# EAGLE schematic Attiny84_PIR_RELE (EAGLE 6.4)
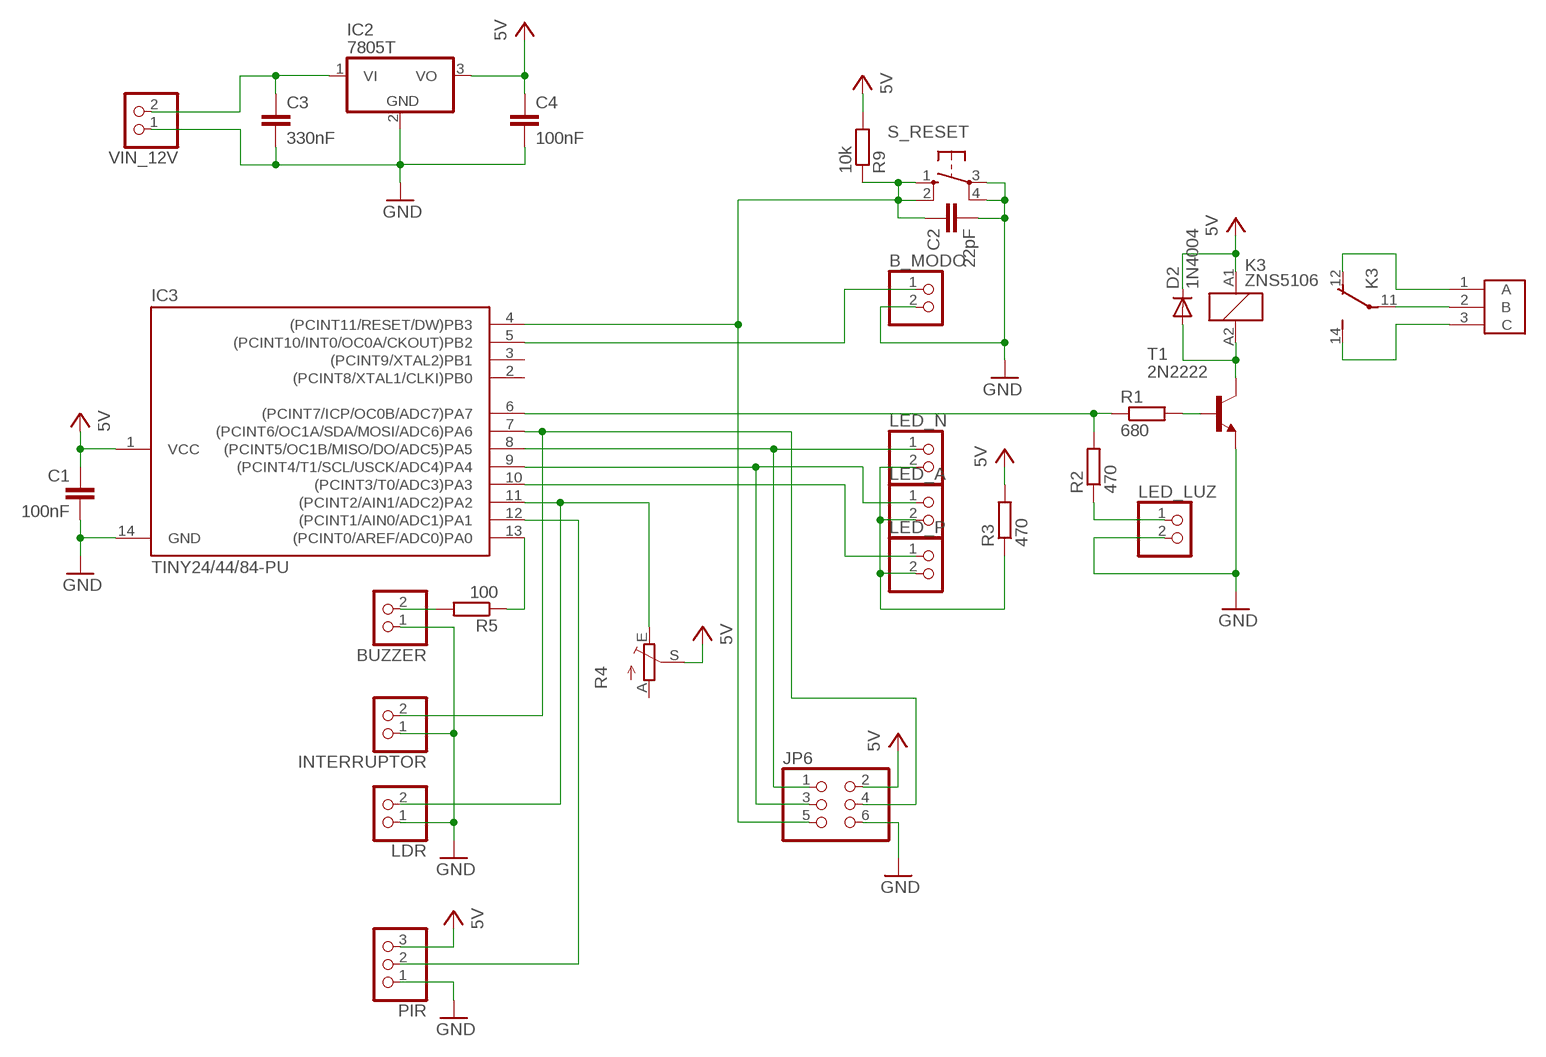
[diagram p0: schematic, sheet 1]

## Parts
B_MODO  PINHD-1X2  [1X02]
BUZZER  PINHD-1X2  [1X02]
C1  100nF  C-EU050-025X075  [C050-025X075]
C2  22pF  C-EU050-025X075  [C050-025X075]
C3  330nF  C-EU050-025X075  [C050-025X075]
C4  100nF  C-EU050-025X075  [C050-025X075]
D2  1N4004  [DO41-10]
IC2  7805T  [TO220H]
IC3  TINY24/44/84-PU  [DIL14]
INTERRUPTOR  PINHD-1X2  [1X02]
JP6  PINHD-2X3  [2X03]
K3  ZNS5106  [ZN5]
LDR  PINHD-1X2  [1X02]
LED_A  PINHD-1X2  [1X02]
LED_LUZ  PINHD-1X2  [1X02]
LED_N  PINHD-1X2  [1X02]
LED_P  PINHD-1X2  [1X02]
PIR  PINHD-1X3  [1X03]
R1  680  R-EU_0204/7  [0204/7]
R2  470  R-EU_0204/7  [0204/7]
R3  470  R-EU_0204/7  [0204/7]
R4  TRIM_EU-LI10  [LI10]
R5  100  R-EU_0204/7  [0204/7]
R9  10k  R-EU_0204/7  [0204/7]
S_RESET  10-XX  [B3F-10XX]
T1  2N2222  [TO18]
U$1  POT_CONNECTOR  [POT_CONNECTOR]
VIN_12V  PINHD-1X2  [1X02]

## Nets
GND: B_MODO.2 BUZZER.1 C1.2 C2.2 C3.2 C4.2 IC2.2(GND) IC3.14(GND) INTERRUPTOR.1 JP6.6 LDR.1 LED_LUZ.2 PIR.1 S_RESET.3(P) S_RESET.4(P1) T1.1(E) VIN_12V.1
MISO: IC3.8((PCINT5/OC1B/MISO/DO/ADC5)PA5) JP6.1 LED_N.1
N$1: B_MODO.1 IC3.5((PCINT10/INT0/OC0A/CKOUT)PB2)
N$2: IC3.7((PCINT6/OC1A/SDA/MOSI/ADC6)PA6) INTERRUPTOR.2 JP6.4
N$3: IC3.11((PCINT2/AIN1/ADC2)PA2) LDR.2 R4.E
N$4: IC3.10((PCINT3/T0/ADC3)PA3) LED_P.1
N$6: IC3.12((PCINT1/AIN0/ADC1)PA1) PIR.2
N$7: BUZZER.2 R5.2
N$8: IC3.13((PCINT0/AREF/ADC0)PA0) R5.1
N$9: C3.1 IC2.1(VI) VIN_12V.2
N$10: LED_A.2 LED_N.2 LED_P.2 R3.1
N$21: K3.11(2:P) U$1.2(B)
N$22: D2.A K3.A2 T1.3(C)
N$23: R1.2 T1.2(B)
N$24: IC3.6((PCINT7/ICP/OC0B/ADC7)PA7) R1.1 R2.2
N$25: K3.12(2:O) U$1.1(A)
N$26: LED_LUZ.1 R2.1
N$33: K3.14(2:S) U$1.3(C)
RESET: C2.1 IC3.4((PCINT11/RESET/DW)PB3) JP6.5 R9.1 S_RESET.1(S) S_RESET.2(S1)
SCK: IC3.9((PCINT4/T1/SCL/USCK/ADC4)PA4) JP6.3 LED_A.1
VCC: C1.1 C4.1 D2.C IC2.3(VO) IC3.1(VCC) JP6.2 K3.A1 PIR.3 R3.2 R4.S R9.2 ; supply symbol labelled 5V
Unconnected: IC3.2((PCINT8/XTAL1/CLKI)PB0) IC3.3((PCINT9/XTAL2)PB1) R4.A

## Library data of the parts
B_MODO BUZZER INTERRUPTOR LDR LED_A LED_LUZ LED_N LED_P VIN_12V = pinhead:PINHD-1X2: PIN HEADER
C1-C4 = rcl:C-EU: CAPACITOR, European symbol
D2 = diode:1N4004: DIODE general purpose rectifier, 1 A
IC2 = linear:78*: Positive VOLTAGE REGULATOR Source: http://cache.national.com/ds/LM/LM78L05.pdf http://www.fairchildsemi.com/ds/LM/LM7805.pdf
IC3 = avr-5:TINY24/44/84
JP6 = pinhead:PINHD-2X3: PIN HEADER
K3 = relay:ZNS5*: Miniature Power PCB Relay SCHRACK 1pole 10 A Source: http://www.schrack.com/.. 5847.pdf; OC_FARNELL: unknown; OC_NEWARK: unknown
PIR = pinhead:PINHD-1X3: PIN HEADER
R1-R3 R5 R9 = rcl:R-EU_: RESISTOR, European symbol
R4 = pot:TRIM_EU-: POTENTIOMETER
S_RESET = switch-omron:10-XX: OMRON SWITCH; MPN: B3F-1000; OC_FARNELL: 176432; OC_NEWARK: 36M3542
T1 = transistor:2N2222: NPN TRANSISTOR
U$1 = mi_lib:POT_CONNECTOR: Conector de potencia de 3 terminales